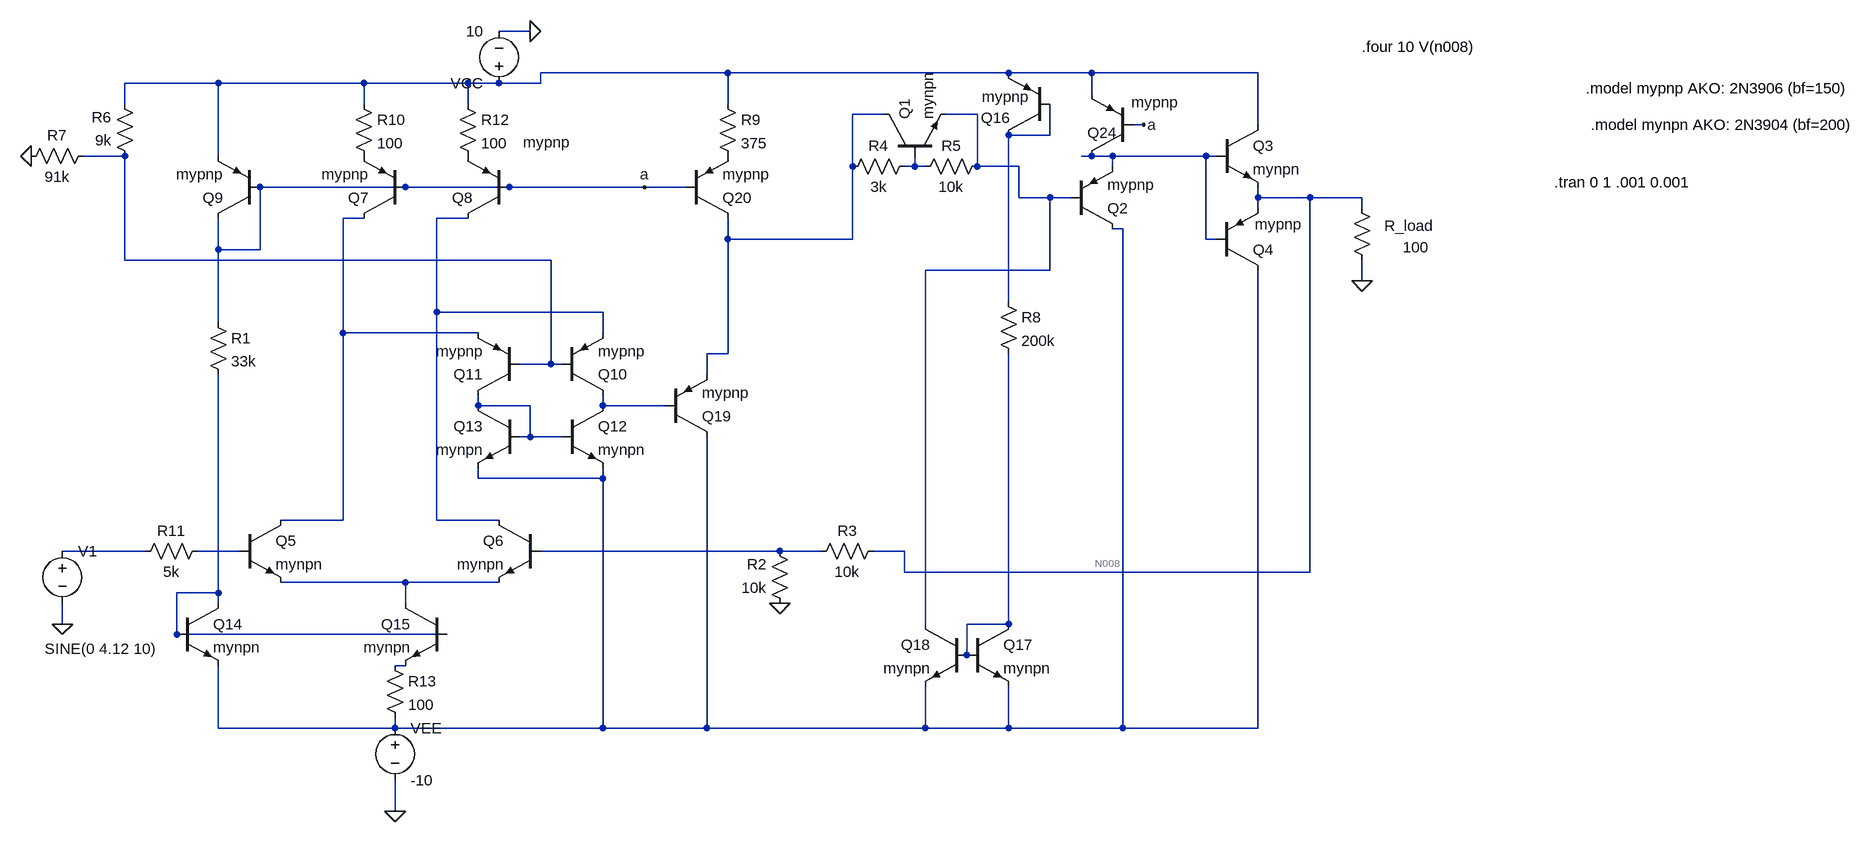
[diagram p0: schematic Draft1.asc]
Draft1.asc, the LTspice schematic file:
Version 4
SHEET 1 1932 952
WIRE -496 -352 -544 -352
WIRE -192 -288 -480 -288
WIRE 240 -288 -192 -288
WIRE 368 -288 240 -288
WIRE 624 -288 368 -288
WIRE -976 -272 -1120 -272
WIRE -752 -272 -976 -272
WIRE -592 -272 -752 -272
WIRE -544 -272 -592 -272
WIRE -480 -272 -480 -288
WIRE -480 -272 -544 -272
WIRE 368 -256 368 -288
WIRE -1120 -240 -1120 -272
WIRE -752 -240 -752 -272
WIRE -592 -240 -592 -272
WIRE -192 -240 -192 -288
WIRE 48 -224 0 -224
WIRE 192 -224 144 -224
WIRE 448 -208 432 -208
WIRE 624 -208 624 -288
WIRE 304 -192 304 -240
WIRE 304 -192 240 -192
WIRE -1120 -160 -1184 -160
WIRE -976 -160 -976 -272
WIRE 368 -160 352 -160
WIRE 400 -160 368 -160
WIRE 544 -160 400 -160
WIRE 560 -160 544 -160
WIRE 0 -144 0 -224
WIRE 96 -144 96 -160
WIRE 96 -144 80 -144
WIRE 112 -144 96 -144
WIRE 192 -144 192 -224
WIRE 256 -144 192 -144
WIRE 400 -144 400 -160
WIRE -688 -112 -912 -112
WIRE -528 -112 -688 -112
WIRE -320 -112 -528 -112
WIRE -256 -112 -320 -112
WIRE 256 -96 256 -144
WIRE 304 -96 256 -96
WIRE 336 -96 304 -96
WIRE 624 -96 624 -112
WIRE 704 -96 624 -96
WIRE 784 -96 704 -96
WIRE 624 -80 624 -96
WIRE 784 -80 784 -96
WIRE -752 -64 -784 -64
WIRE -592 -64 -640 -64
WIRE 416 -48 400 -48
WIRE -192 -32 -192 -64
WIRE 0 -32 0 -144
WIRE 0 -32 -192 -32
WIRE 544 -32 544 -160
WIRE 560 -32 544 -32
WIRE -976 -16 -976 -64
WIRE -912 -16 -912 -112
WIRE -912 -16 -976 -16
WIRE -1120 0 -1120 -160
WIRE -464 0 -1120 0
WIRE 304 16 304 -96
WIRE 304 16 112 16
WIRE 784 32 784 0
WIRE 240 64 240 -192
WIRE -640 80 -640 -64
WIRE -384 80 -640 80
WIRE -976 96 -976 -16
WIRE -784 112 -784 -64
WIRE -576 112 -784 112
WIRE -384 112 -384 80
WIRE -192 144 -192 -32
WIRE -192 144 -224 144
WIRE -464 160 -464 0
WIRE -464 160 -512 160
WIRE -448 160 -464 160
WIRE -224 176 -224 144
WIRE -576 224 -576 208
WIRE -496 224 -576 224
WIRE -384 224 -384 208
WIRE -288 224 -384 224
WIRE -496 272 -496 224
WIRE -496 272 -512 272
WIRE -448 272 -496 272
WIRE -576 336 -576 320
WIRE -384 336 -384 320
WIRE -384 336 -576 336
WIRE -784 400 -784 112
WIRE -784 400 -880 400
WIRE -640 400 -640 80
WIRE -544 400 -640 400
WIRE -1088 448 -1216 448
WIRE -944 448 -1008 448
WIRE -112 448 -480 448
WIRE -48 448 -112 448
WIRE 80 448 32 448
WIRE 80 480 80 448
WIRE 704 480 704 -96
WIRE 704 480 80 480
WIRE -688 496 -880 496
WIRE -544 496 -688 496
WIRE -976 512 -976 176
WIRE -976 512 -1040 512
WIRE -976 528 -976 512
WIRE -688 528 -688 496
WIRE -1216 560 -1216 528
WIRE 112 560 112 16
WIRE 240 560 240 144
WIRE 240 560 176 560
WIRE -1040 576 -1040 512
WIRE -624 576 -1040 576
WIRE 176 608 176 560
WIRE -688 624 -704 624
WIRE -976 720 -976 624
WIRE -704 720 -704 704
WIRE -704 720 -976 720
WIRE -384 720 -384 336
WIRE -384 720 -704 720
WIRE -224 720 -224 272
WIRE -224 720 -384 720
WIRE 112 720 112 656
WIRE 112 720 -224 720
WIRE 240 720 240 656
WIRE 240 720 112 720
WIRE 416 720 416 -48
WIRE 416 720 240 720
WIRE 624 720 624 16
WIRE 624 720 416 720
WIRE -704 848 -704 800
FLAG -704 848 0
FLAG -496 -352 0
FLAG -112 528 0
FLAG 784 32 0
FLAG -1216 560 0
FLAG -1264 -160 0
FLAG -320 -112 a
FLAG 448 -208 a
SYMBOL voltage -544 -256 R180
WINDOW 123 0 0 Left 0
WINDOW 39 0 0 Left 0
SYMATTR InstName VCC
SYMATTR Value 10
SYMBOL voltage -704 704 R0
WINDOW 123 0 0 Left 0
WINDOW 39 0 0 Left 0
SYMATTR InstName VEE
SYMATTR Value -10
SYMBOL res -96 544 R180
WINDOW 0 36 76 Left 2
WINDOW 3 36 40 Left 2
SYMATTR InstName R2
SYMATTR Value 10k
SYMBOL res 48 432 R90
WINDOW 0 0 56 VBottom 2
WINDOW 3 32 56 VTop 2
SYMATTR InstName R3
SYMATTR Value 10k
SYMBOL res 96 -160 R90
WINDOW 0 0 56 VBottom 2
WINDOW 3 32 56 VTop 2
SYMATTR InstName R4
SYMATTR Value 3k
SYMBOL res 208 -160 R90
WINDOW 0 0 56 VBottom 2
WINDOW 3 32 56 VTop 2
SYMATTR InstName R5
SYMATTR Value 10k
SYMBOL res 800 16 R180
WINDOW 0 -95 69 Left 2
WINDOW 3 -87 36 Left 2
SYMATTR InstName R_load
SYMATTR Value 100
SYMBOL npn 48 -160 R270
SYMATTR InstName Q1
SYMATTR Value mynpn
SYMBOL npn 560 -208 R0
SYMATTR InstName Q3
SYMATTR Value mynpn
SYMBOL pnp 336 -48 M180
SYMATTR InstName Q2
SYMATTR Value mypnp
SYMBOL pnp 560 16 M180
WINDOW 3 59 71 Left 2
SYMATTR InstName Q4
SYMATTR Value mypnp
SYMBOL npn -944 400 R0
SYMATTR InstName Q5
SYMATTR Value mynpn
SYMBOL npn -480 400 M0
SYMATTR InstName Q6
SYMATTR Value mynpn
SYMBOL pnp -688 -64 R180
SYMATTR InstName Q7
SYMATTR Value mypnp
SYMBOL pnp -528 -64 R180
WINDOW 3 -94 117 Left 2
SYMATTR Value mypnp
SYMATTR InstName Q8
SYMBOL pnp -448 208 M180
SYMATTR InstName Q10
SYMATTR Value mypnp
SYMBOL pnp -512 208 R180
SYMATTR InstName Q11
SYMATTR Value mypnp
SYMBOL npn -448 224 R0
SYMATTR InstName Q12
SYMATTR Value mynpn
SYMBOL npn -512 224 M0
SYMATTR InstName Q13
SYMATTR Value mynpn
SYMBOL voltage -1216 432 R0
WINDOW 123 0 0 Left 0
WINDOW 39 0 0 Left 0
WINDOW 3 -27 166 Left 2
SYMATTR InstName V1
SYMATTR Value SINE(0 4.12 10)
SYMBOL res -1104 -144 R180
WINDOW 0 36 76 Left 2
WINDOW 3 36 40 Left 2
SYMATTR InstName R6
SYMATTR Value 9k
SYMBOL res -1280 -144 R270
WINDOW 0 32 56 VTop 2
WINDOW 3 0 56 VBottom 2
SYMATTR InstName R7
SYMATTR Value 91k
SYMBOL pnp -912 -64 R180
SYMATTR InstName Q9
SYMATTR Value mypnp
SYMBOL npn -1040 528 R0
SYMATTR InstName Q14
SYMATTR Value mynpn
SYMBOL npn -624 528 M0
SYMATTR InstName Q15
SYMATTR Value mynpn
SYMBOL res -992 80 R0
SYMATTR InstName R1
SYMATTR Value 33k
SYMBOL pnp 304 -192 R180
WINDOW 0 61 27 Left 2
WINDOW 3 32 59 Left 2
SYMATTR InstName Q16
SYMATTR Value mypnp
SYMBOL npn 176 560 R0
SYMATTR InstName Q17
SYMATTR Value mynpn
SYMBOL res 224 48 R0
SYMATTR InstName R8
SYMATTR Value 200k
SYMBOL npn 176 560 M0
SYMATTR InstName Q18
SYMATTR Value mynpn
SYMBOL pnp -288 272 M180
SYMATTR InstName Q19
SYMATTR Value mypnp
SYMBOL pnp -256 -64 M180
SYMATTR InstName Q20
SYMATTR Value mypnp
SYMBOL pnp 432 -160 R180
WINDOW 0 25 36 Left 2
WINDOW 3 -70 83 Left 2
SYMATTR InstName Q24
SYMATTR Value mypnp
SYMBOL res -992 432 R90
WINDOW 0 0 56 VBottom 2
WINDOW 3 32 56 VTop 2
SYMATTR InstName R11
SYMATTR Value 5k
SYMBOL res -208 -256 R0
SYMATTR InstName R9
SYMATTR Value 375
SYMBOL res -768 -256 R0
SYMATTR InstName R10
SYMATTR Value 100
SYMBOL res -608 -256 R0
SYMATTR InstName R12
SYMATTR Value 100
SYMBOL res -720 608 R0
SYMATTR InstName R13
SYMATTR Value 100
TEXT 1128 -264 Left 2 !.model mypnp AKO: 2N3906 (bf=150)
TEXT 1136 -208 Left 2 !.model mynpn AKO: 2N3904 (bf=200)
TEXT 784 -328 Left 2 !.four 10 V(n008)
TEXT 1080 -120 Left 2 !.tran 0 1 .001 0.001

The netlist it stands for:
* Draft1.asc
VCC N001 0 10
VEE N011 0 -10
R2 0 N016 10k
R3 N008 N016 10k
R4 N007 N002 3k
R5 N003 N007 10k
R_load 0 N008 100
Q1 N002 N007 N003 0 mynpn
Q3 N001 N006 N008 0 mynpn
Q2 N011 N003 N006 0 mypnp
Q4 N011 N006 N008 0 mypnp
Q5 N009 N015 N017 0 mynpn
Q6 N010 N016 N017 0 mynpn
Q7 N009 a P001 0 mypnp
Q8 N010 a P002 0 mypnp
Q10 N013 N005 N010 0 mypnp
Q11 N012 N005 N009 0 mypnp
Q12 N013 N012 N011 0 mynpn
Q13 N012 N012 N011 0 mynpn
V1 N014 0 SINE(0 4.12 10)
R6 N005 N001 9k
R7 0 N005 91k
Q9 a a N001 0 mypnp
Q14 N018 N018 N011 0 mynpn
Q15 N017 N018 N020 0 mynpn
R1 a N018 33k
Q16 N004 N004 N001 0 mypnp
Q17 N019 N019 N011 0 mynpn
R8 N004 N019 200k
Q18 N003 N019 N011 0 mynpn
Q19 N011 N013 N002 0 mypnp
Q20 N002 a P003 0 mypnp
Q24 N006 a N001 0 mypnp
R11 N015 N014 5k
R9 N001 P003 375
R10 N001 P001 100
R12 N001 P002 100
R13 N020 N011 100
.model NPN NPN
.model PNP PNP
.lib standard.bjt
.model mypnp AKO: 2N3906 (bf=150)
.model mynpn AKO: 2N3904 (bf=200)
.four 10 V(n008)
.tran 0 1 .001 0.001
.backanno
.end